# Altium schematic sheet Drive.SchDoc
size 330 x 241 mm; SheetNumber: 1; SheetTotal: 1
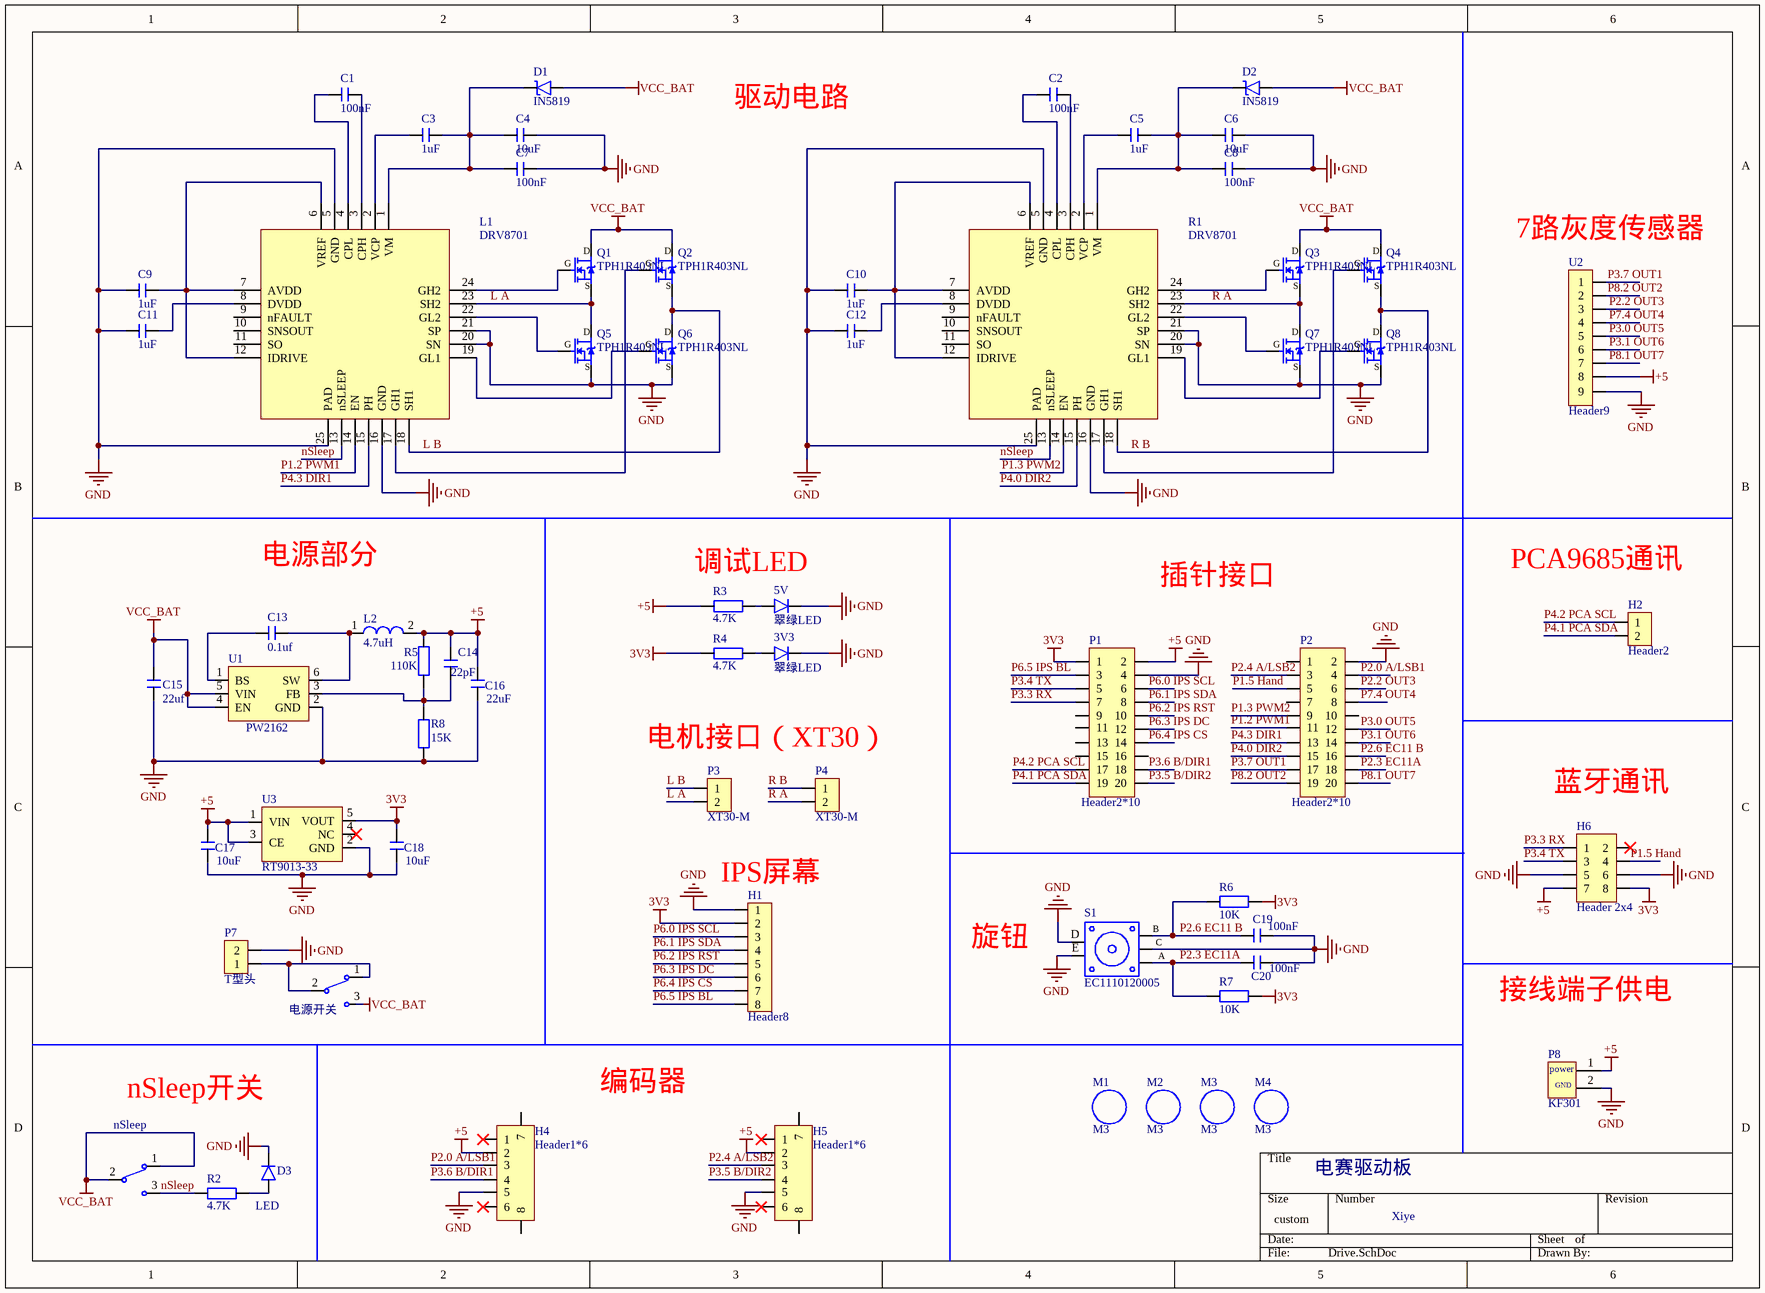
[diagram p0: Drive.SchDoc]

## Parts
3V3  翠绿LED  [翠绿LED]
5V  翠绿LED  [翠绿LED]
C1  100nF  [0603]
C2  100nF  [0603]
C3  1uF  [0603]
C4  10uF  [0603]
C5  1uF  [0603]
C6  10uF  [0603]
C7  100nF  [0603]
C8  100nF  [0603]
C9  1uF  [0603]
C10  1uF  [0603]
C11  1uF  [0603]
C12  1uF  [0603]
C13  0.1uf  [0603]
C14  22pF  [0603]
C15  22uf  [0603]
C16  22uF  [0603]
C17  10uF  [0603]
C18  10uF  [0603]
C19  100nF  [0603]
C20  100nF  [0603]
D1  IN5819  [IN5819]
D2  IN5819  [IN5819]
D3  LED  [翠绿LED]
H1  Header8  [Header8]
H2  Header2  [Header2]
H4  Header1*6  [XH 1x6p 直插]
H5  Header1*6  [XH 1x6p 直插]
H6  Header 2x4  [Header2x4]
L1  DRV8701  [DRV8701]
L2  4.7uH  [252010]
M1  M3  [M3限位孔]
M2  M3  [M3限位孔]
M3  M3  [M3限位孔]
M4  M3  [M3限位孔]
nSleep  nSleep  [扭子开关3脚]
P1  Header2*10  [2*10排母]
P2  Header2*10  [2*10排母]
P3  XT30-M  [XT30-M - duplicate]
P4  XT30-M  [XT30-M - duplicate]
P7  T型头  [T型头]
P8  KF301  [KF301-2P]
Q1  TPH1R403NL  [TPH1R403NL]
Q2  TPH1R403NL  [TPH1R403NL]
Q3  TPH1R403NL  [TPH1R403NL]
Q4  TPH1R403NL  [TPH1R403NL]
Q5  TPH1R403NL  [TPH1R403NL]
Q6  TPH1R403NL  [TPH1R403NL]
Q7  TPH1R403NL  [TPH1R403NL]
Q8  TPH1R403NL  [TPH1R403NL]
R1  DRV8701  [DRV8701]
R2  4.7K  [0603]
R3  4.7K  [0603]
R4  4.7K  [0603]
R5  110K  [0603]
R6  10K  [0603]
R7  10K  [0603]
R8  15K  [0603]
S1  EC1110120005  [EC1110120005]
U1  PW2162  [SOT23-6]
U2  Header9  [Header9]
U3  RT9013-33  [SOP23-5]
电源开关  电源输入  [扭子开关3脚]  (value not drawn)

## Nets
3V3: C18.2 H1.2 H6.8 P1.1 R4.2 R6.2 R7.2 U3.5(VOUT)
+5: C14.2 C16.2 C17.2 H4.2 H5.2 H6.7 L2.2 P1.2 P8.1(Power) R3.2 R5.2 U2.8 U3.1(VIN) U3.3(CE)
GND: 3V3.2 5V.2 C4.2 C6.2 C7.2 C8.2 C9.1 C10.1 C11.1 C12.1 C15.1 C16.1 C17.1 C18.1 C19.2 C20.2 D3.2 H1.1 H4.5 H5.5 H6.5 H6.6 L1.5(GND) L1.16(GND) L1.20(SN) L1.21(SP) L1.25(PAD) P1.4 P2.2 P7.2 P8.2 Q5.2(S) Q6.2(S) Q7.2(S) Q8.2(S) R1.5(GND) R1.16(GND) R1.20(SN) R1.21(SP) R1.25(PAD) R8.1 S1.C S1.D S1.E U1.2(GND) U2.9 U3.2(GND)
VCC_BAT: C15.2 D1.1 D2.1 nSleep.1 nSleep.2 Q1.3(D) Q2.3(D) Q3.3(D) Q4.3(D) U1.4(EN) U1.5(VIN) 电源开关.3
L A: L1.23(SH2) P3.2 Q1.2(S) Q5.3(D)
L B: L1.18(SH1) P3.1 Q2.2(S) Q6.3(D)
nSleep: L1.13(nSLEEP) nSleep.3 R1.13(nSLEEP) R2.1
P1.2 PWM1: L1.14(EN) P2.11
P1.3 PWM2: P2.9 R1.14(EN)
P1.5 Hand: H6.4 P2.5
P2.0 A/LSB1: H4.3 P2.4
P2.2 OUT3: P2.6 U2.3
P2.3 EC11A: C20.1 P2.18 R7.1 S1.A
P2.4 A/LSB2: H5.3 P2.3
P2.6 EC11 B: C19.1 P2.16 R6.1 S1.B
P3.0 OUT5: P2.12 U2.5
P3.1 OUT6: P2.14 U2.6
P3.3 RX: H6.1 P1.7
P3.4 TX: H6.3 P1.5
P3.5 B/DIR2: H5.4 P1.20
P3.6 B/DIR1: H4.4 P1.18
P3.7 OUT1: P2.17 U2.1
P4.0 DIR2: P2.15 R1.15(PH)
P4.1 PCA SDA: H2.2 P1.19
P4.2 PCA SCL: H2.1 P1.17
P4.3 DIR1: L1.15(PH) P2.13
P6.0 IPS SCL: H1.3 P1.6
P6.1 IPS SDA: H1.4 P1.8
P6.2 IPS RST: H1.5 P1.10
P6.3 IPS DC: H1.6 P1.12
P6.4 IPS CS: H1.7 P1.14
P6.5 IPS BL: H1.8 P1.3
P7.4 OUT4: P2.8 U2.4
P8.1 OUT7: P2.20 U2.7
P8.2 OUT2: P2.19 U2.2
R A: P4.2 Q3.2(S) Q7.3(D) R1.23(SH2)
R B: P4.1 Q4.2(S) Q8.3(D) R1.18(SH1)
Net3V3_1: 3V3.1 R4.1
Net5V_1: 5V.1 R3.1
NetC1_1: C1.1 L1.4(CPL)
NetC1_2: C1.2 L1.3(CPH)
NetC2_1: C2.1 R1.4(CPL)
NetC2_2: C2.2 R1.3(CPH)
NetC3_1: C3.1 L1.2(VCP)
NetC3_2: C3.2 C4.1 C7.1 D1.2 L1.1(VM)
NetC5_1: C5.1 R1.2(VCP)
NetC5_2: C5.2 C6.1 C8.1 D2.2 R1.1(VM)
NetC9_2: C9.2 L1.6(VREF) L1.7(AVDD) L1.12(IDRIVE)
NetC10_2: C10.2 R1.6(VREF) R1.7(AVDD) R1.12(IDRIVE)
NetC11_2: C11.2 L1.8(DVDD)
NetC12_2: C12.2 R1.8(DVDD)
NetC13_1: C13.1 U1.1(BS)
NetC13_2: C13.2 L2.1 U1.6(SW)
NetC14_1: C14.1 R5.1 R8.2 U1.3(FB)
NetD3_1: D3.1 R2.2
NetL1_17: L1.17(GH1) Q2.1(G)
NetL1_19: L1.19(GL1) Q6.1(G)
NetL1_22: L1.22(GL2) Q5.1(G)
NetL1_24: L1.24(GH2) Q1.1(G)
NetP7_1: P7.1 电源开关.1 电源开关.2
NetQ3_1: Q3.1(G) R1.24(GH2)
NetQ4_1: Q4.1(G) R1.17(GH1)
NetQ7_1: Q7.1(G) R1.22(GL2)
NetQ8_1: Q8.1(G) R1.19(GL1)

Not connected (* = marked no-connect by the designer): H4 1* 6* 7 8; H5 1* 6* 7 8; H6 2*; L1 9(nFAULT) 10(SNSOUT) 11(SO); P1 9 11 13 15 16; P2 1 7 10; R1 9(nFAULT) 10(SNSOUT) 11(SO); U3 4(NC)*

## Notes on the sheet
- 驱动电路
- (near U2) 7路灰度传感器
- 电源部分
- (near H2) PCA9685通讯
- 调试LED
- 插针接口
- 电机接口（XT30）
- (near H6) 蓝牙通讯
- (near H1) IPS屏幕
- 旋钮
- 接线端子供电
- nSleep开关
- 编码器
- 电赛驱动板
- Xiye
- (in symbol KF301) power; GND

## Library data of the parts
C1-C20 = 电容
D1 D2 = IN5819: 肖特基二极管
D3 = 翠绿LED
H1 = Header8: 插针1*8 2.54mm
L1 R1 = DRV8701: 刷式直流电机驱动器
L2 = 电感
nSleep 电源开关 = 扭子开关 三脚: MT-0-103-A101-M200
P8 = KF301: 接线端子
Q1-Q8 = TPH1R403NL: MOS管
R2-R8 = 电阻
S1 = EC1110120005: 旋钮
U1 = PW2162: 降压芯片
U3 = TPRT9013-33: 5v转3v3 限流500mA